# EAGLE design ct-Motor2 (EAGLE 4.15)
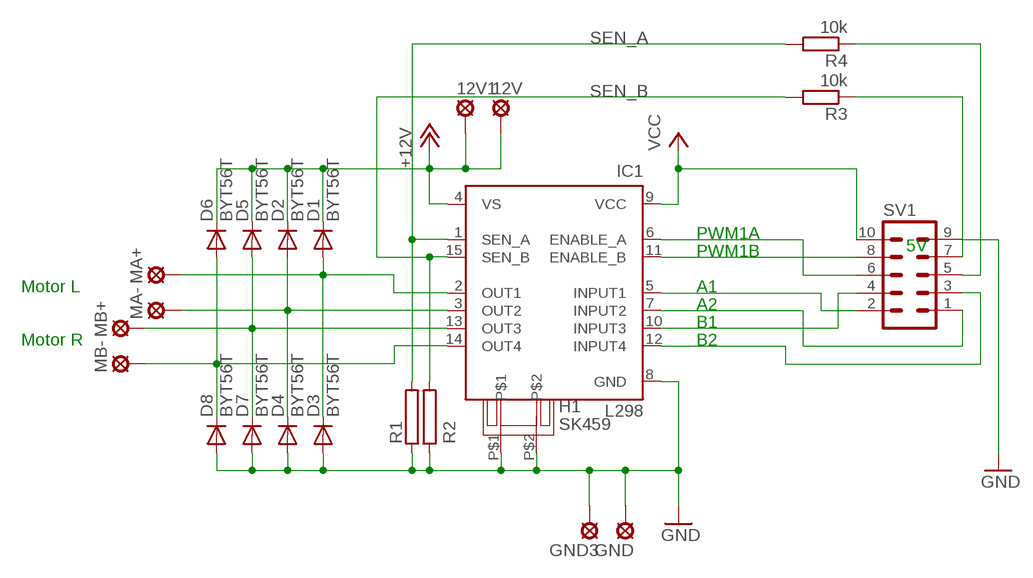
[diagram p0: schematic, sheet 1]

## Parts
12V  LSP10  [LSP10]
12V1  LSP10  [LSP10]
D1  BYT56T  [SOD64-18]
D2  BYT56T  [SOD64-18]
D3  BYT56T  [SOD64-18]
D4  BYT56T  [SOD64-18]
D5  BYT56T  [SOD64-18]
D6  BYT56T  [SOD64-18]
D7  BYT56T  [SOD64-18]
D8  BYT56T  [SOD64-18]
GND  LSP10  [LSP10]
GND3  LSP10  [LSP10]
H1  SK459  [SK459]
IC1  L298  [MULTIWATT-15]
MA+  LSP10  [LSP10]
MA-  LSP10  [LSP10]
MB+  LSP10  [LSP10]
MB-  LSP10  [LSP10]
R1  RKH208-8  [KH208-8]
R2  RKH208-8  [KH208-8]
R3  10k  R-EU_0207/10  [0207/10]
R4  10k  R-EU_0207/10  [0207/10]
SV1  ML10  [ML10]

## Nets
+12V [+12V]: 12V1.MP 12V.MP D1.C D2.C D5.C D6.C IC1.4(VS)
GND: D3.A D4.A D7.A D8.A GND3.MP GND.MP H1.P$1 H1.P$2 IC1.8(GND) R1.1 R2.1 SV1.9
M1: IC1.5(INPUT1) SV1.2
M2: IC1.10(INPUT3) SV1.4
MOTORA+ [MOTORA+]: D1.A D3.C IC1.2(OUT1) MA+.MP
MOTORA- [MOTORA-]: D2.A D4.C IC1.3(OUT2) MA-.MP
MOTORB+ [MOTORB+]: D5.A D7.C IC1.13(OUT3) MB+.MP
MOTORB- [MOTORb-]: D6.A D8.C IC1.14(OUT4) MB-.MP
N$1: R3.1 SV1.7
N$2: IC1.7(INPUT2) SV1.1
N$3: R4.1 SV1.5
N$4: IC1.12(INPUT4) SV1.3
PWM1A: IC1.6(ENABLE_A) SV1.6
PWM1B: IC1.11(ENABLE_B) SV1.8
SEN_A [+12V]: IC1.1(SEN_A) R1.2 R4.2
SEN_B [+12V]: IC1.15(SEN_B) R2.2 R3.2
VCC: IC1.9(VCC) SV1.10

## Notes on the sheet
- PWM1A | 5V
- PWM1B
- Motor L | A1
- A2
- B1
- Motor R | B2

## Library data of the parts
12V 12V1 GND GND3 MA+ MA- MB+ MB- = solpad:LSP10: SOLDER PAD drill 1.0 mm, distributor Buerklin, 12H555
D1-D8 = diode:BYT56T: DIODE diameter 4.8 mm, vertical, grid 10.16 mm
H1 = heatsink:SK459
IC1 = st-microelectronics:L298: DUAL FULL-BRIDGE DRIVER
R1 R2 = resistor-power:R: Power Resitor
R3 R4 = rcl:R-EU_: RESISTOR, European symbol
SV1 = con-harting-ml:ML10: HARTING

## Net classes
1 +12V: width 1.27 mm, drill 0.406 mm, clearance 0.584 mm
2 GND: width 1.016 mm, drill 0.406 mm
3 MOTORA+: width 1.27 mm, drill 0.813 mm, clearance 0.406 mm
4 MOTORA-: width 1.27 mm, drill 0.813 mm, clearance 0.406 mm
5 MOTORB+: width 1.27 mm, drill 0.813 mm, clearance 0.406 mm
6 MOTORb-: width 1.27 mm, drill 0.813 mm, clearance 0.406 mm

## Board
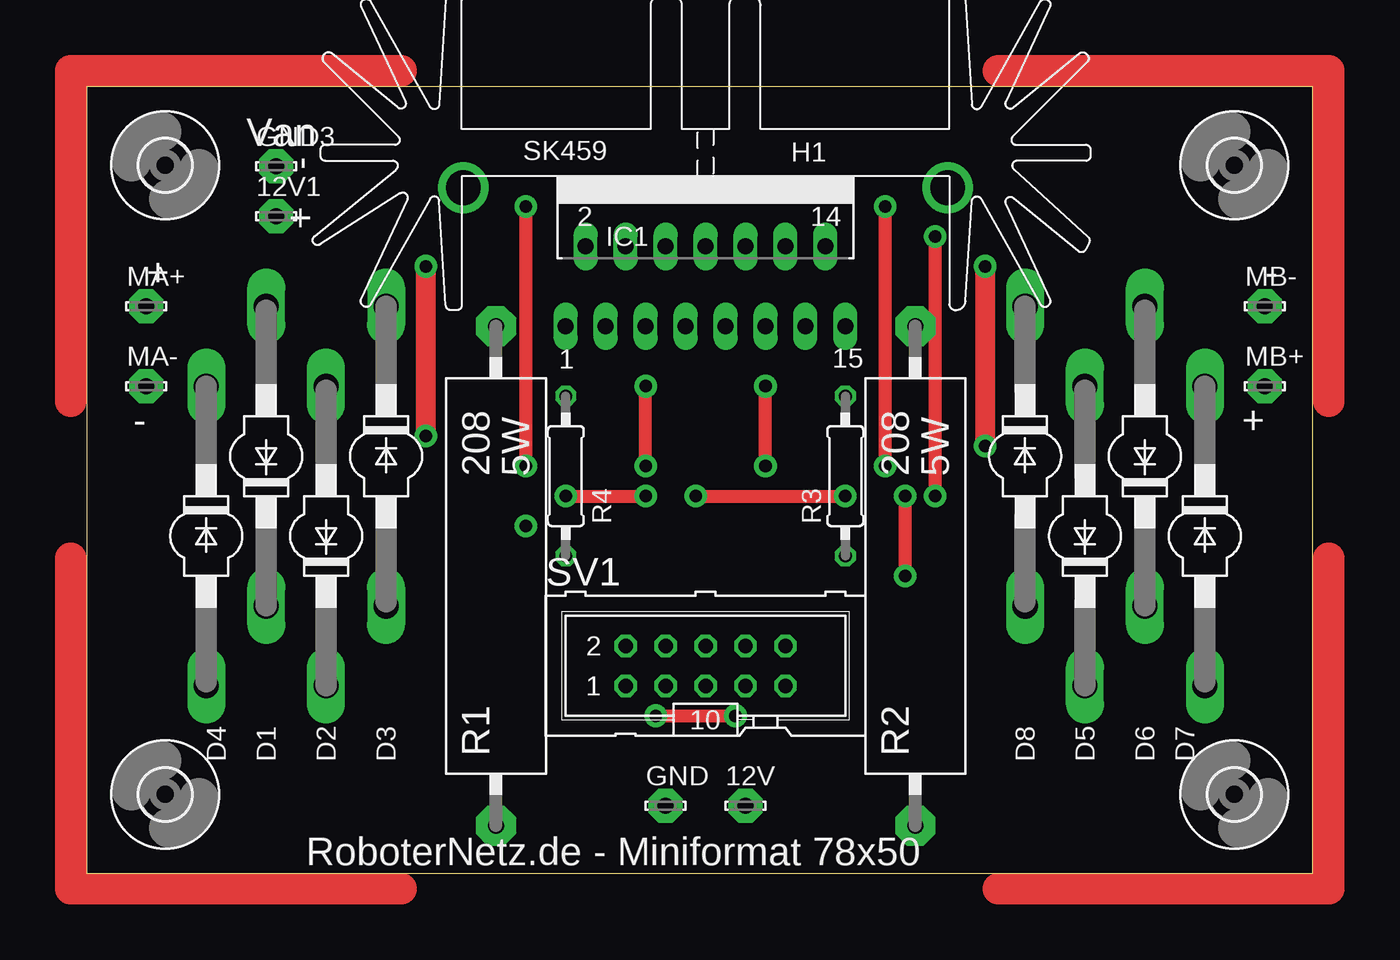
[diagram p1: board, top side]
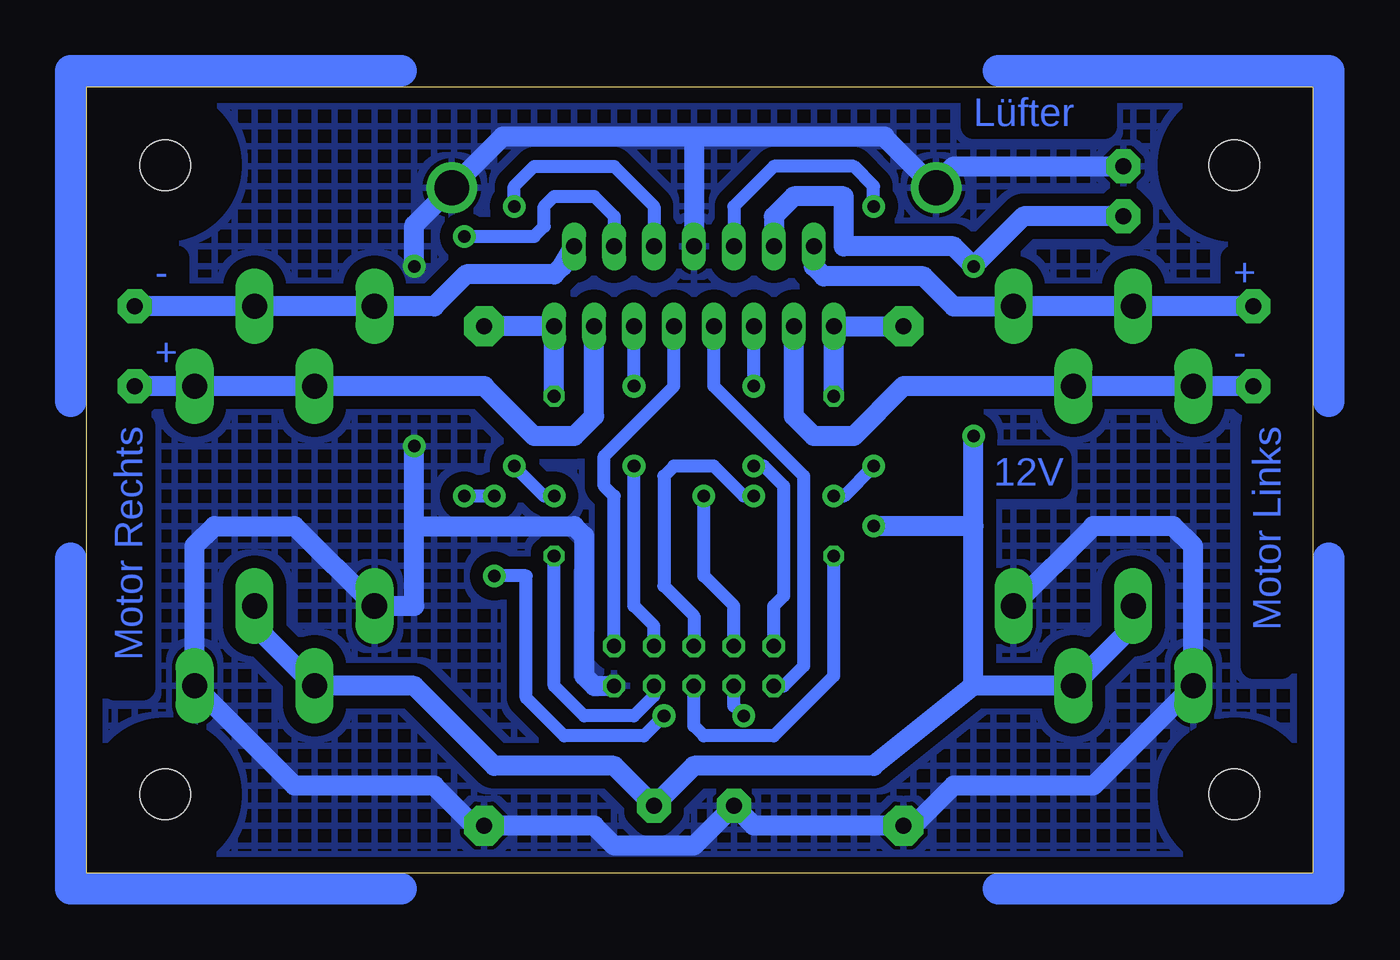
[diagram p2: board, bottom side, seen from below]

Size 78 x 50 mm. Coordinates in mm from the lower left corner, seen from the top.
Outline: 0,50 0,0 78,0 78,50 0,50
Copper layers (1*16): Top 0.035mm / dielectric 1.5mm / Bottom 0.035mm
Design rules "dick": minimum track width 32mil, minimum drill 24mil, track to track 16mil, track to pad 16mil, pad to pad 16mil, via to via 16mil, smd to smd 8mil, copper to edge 40mil, drill to drill 8mil, minimum pad ring 10mil, minimum via ring 8mil, stop-mask expansion 4mil, vias tented up to drill 0mil, thermal gap 10mil

### Footprints (pad centres in the part's own frame; a part is rotated, then mirrored left to right if it is on the bottom)
LSP10 = drill 1.016 pad 2.159 octagon: MP 0,0
SOD64-18 = drill 1.6 long: A 9.525,0; C -9.525,0
SK459 = drill 2.2 round: P$1 -15.4,0.72; P$2 15.4,0.72
MULTIWATT-15 = drill 1.016 long: 1 -8.89,-7.62; 2 -7.62,-2.54; 3 -6.35,-7.62; 4 -5.08,-2.54; 5 -3.81,-7.62; 6 -2.54,-2.54; 7 -1.27,-7.62; 8 0,-2.54; 9 1.27,-7.62; 10 2.54,-2.54; 11 3.81,-7.62; 12 5.08,-2.54; 13 6.35,-7.62; 14 7.62,-2.54; 15 8.89,-7.62
KH208-8 = drill 1.016 pad 2.54 octagon: 1 -15.875,0; 2 15.875,0
0207/10 = drill 0.813 octagon: 1 -5.08,0; 2 5.08,0
ML10 = drill 0.914 octagon: 1 -5.08,-1.27; 2 -5.08,1.27; 3 -2.54,-1.27; 4 -2.54,1.27; 5 0,-1.27; 6 0,1.27; 7 2.54,-1.27; 8 2.54,1.27; 9 5.08,-1.27; 10 5.08,1.27
3,2 = hole 3.2: 0,0

### Placement (x,y rotation side)
12V  41.91,4.28 0 top
12V1  12.06,41.75 0 top
D1  11.43,26.5 90 top
D2  15.24,21.43 90 top
D3  19.05,26.5 270 top
D4  7.62,21.43 270 top
D5  63.5,21.43 90 top
D6  67.31,26.5 90 top
D7  71.12,21.43 270 top
D8  59.69,26.5 270 top
GND  36.83,4.28 0 top
GND3  12.06,44.92 0 top
H1  39.37,44.29 180 top
IC1  39.37,42.38 0 top
MA+  3.81,36.03 0 top
MA-  3.81,30.95 0 top
MB+  74.93,30.95 0 top
MB-  74.93,36.03 0 top
R1  26.04,18.88 90 top
R2  52.7,18.88 90 top
R3  48.26,25.23 90 top
R4  30.48,25.23 90 top
SV1  39.37,13.17 0 top
U$1  [3,2]  5,45 270 top
U$2  [3,2]  5,5 270 top
U$3  [3,2]  73,45 270 top
U$4  [3,2]  73,5 270 top

### Tracks (layer width: path | path; a pad name or v marks a point on that pad's centre or on a via)
+12V  (via drill 0.8)
  Top 1.27: v21.59,27.77 v21.59,38.57
  Bottom 1.27: D6.C 67.31,15.71 D5.C 57.15,11.9 52.07,6.82 44.45,6.82 12V.MP 39.37,6.82 27.94,6.82 21.59,11.9 | D1.C 11.43,15.71 D2.C 21.59,11.9 | 21.59,11.9 21.59,22.06 | 21.59,22.06 v21.59,27.77 | IC1.4 34.29,41.75 33.02,43.02 29.84,43.02 29.84,39.84 22.86,39.84 v21.59,38.57 18.41,41.75 12V1.MP | 21.59,22.06 v27.94,22.06
GND  (via drill 0.8)
  Top 1.27: v57.15,27.14 v57.15,38.57
  Bottom 1.27: 45.72,3.01 R2.1 | 45.72,3.01 44.45,1.74 39.37,1.74 GND.MP 35.56,3.01 R1.1 25.4,3.01 22.86,5.55 13.97,5.55 D4.A 7.62,20.79 8.89,22.06 13.97,22.06 D3.A | 45.72,3.01 53.34,3.01 55.88,5.55 64.77,5.55 D7.A 71.12,20.79 69.85,22.06 64.77,22.06 D8.A 57.15,16.98 57.15,22.06 | 57.15,22.06 v57.15,27.14 | SV1.9 45.72,11.9 46.35,12.54 46.35,21.43 46.99,22.06 57.15,22.06 | 39.37,46.83 IC1.8 | 39.37,46.83 27.23,46.83 27.23,46.75 24.13,43.65 | 39.37,46.83 51.51,46.83 H1.P$1 57.15,41.19 v57.15,38.57 | GND3.MP 22.86,44.92 24.13,43.65 | 24.13,43.65 24.05,43.57 H1.P$2
  pour Bottom (isolate 0.813, hatched): 0,50 0,0.47 77.47,0.47 77.47,50
M1  (via drill 0.8)
  Top 0.813: v35.56,25.87 v35.56,30.95
  Bottom 0.813: v35.56,30.95 IC1.5 | SV1.2 34.29,16.98 33.66,17.61 33.66,24.6 34.92,25.87 v35.56,25.87
M2  (via drill 0.8)
  Top 0.813: v38.73,23.96 v48.26,23.96 | v50.8,25.87 v50.8,42.38
  Bottom 0.813: IC1.10 41.91,42.38 44.45,44.92 49.53,44.92 50.8,43.65 v50.8,42.38 | SV1.4 36.83,16.98 38.73,18.88 v38.73,23.96 | v48.26,23.96 48.9,23.96 v50.8,25.87
MOTORA+
  Bottom 1.27: MA+.MP D1.A D3.C 22.86,36.03 24.77,37.94 31.11,37.94 31.75,38.57 IC1.2
MOTORA-
  Bottom 1.27: MA-.MP D4.C D2.A 26.04,30.95 29.21,27.77 31.75,27.77 33.02,29.04 IC1.3
MOTORB+
  Bottom 1.27: MB+.MP D7.C D5.A 52.7,30.95 49.53,27.77 46.99,27.77 45.72,29.04 IC1.13
MOTORB-
  Bottom 1.27: IC1.14 47.75,38.57 48.26,38.06 53.85,38.06 55.88,36.03 D8.C D6.A MB-.MP
N$1
  Bottom 0.813: R3.1 48.26,11.9 46.35,9.99 43.18,9.99 41.91,11.26 SV1.7
N$2
  Bottom 0.813: SV1.1 33.66,11.9 32.38,13.17 32.38,25.23 38.1,30.95 IC1.7
N$3
  Bottom 0.813: R4.1 30.48,12.54 34.29,8.72 38.73,8.72 39.37,9.36 SV1.5
N$4  (via drill 0.8)
  Top 0.813: v53.98,23.96 v53.98,40.48 | v52.07,18.88 v52.07,23.96 | v36.2,9.99 v41.27,9.99 v36.2,9.99
  Bottom 0.813: v41.27,9.99 42.55,8.72 47.62,8.72 50.04,11.14 50.04,18.88 v52.07,18.88 | SV1.3 36.83,10.63 v36.2,9.99 | IC1.12 44.45,41.75 45.72,43.02 48.26,43.02 48.9,42.38 48.9,41.11 49.53,40.48 v53.98,40.48 | v52.07,23.96 v53.98,23.96
N$5
  Top 2: -1,30 -1,51 20,51
N$6
  Top 2: -1,20 -1,-1 20,-1
N$7
  Top 2: 79,30 79,51 58,51
N$8
  Top 2: 58,-1 79,-1 79,20
N$9
  Bottom 2: -1,30 -1,51 20,51
N$10
  Bottom 2: -1,20 -1,-1 20,-1
N$11
  Bottom 2: 79,30 79,51 58,51
N$12
  Bottom 2: 58,-1 79,-1 79,20
PWM1A  (via drill 0.8)
  Top 0.813: v30.48,23.96 v35.56,23.96 | v27.94,25.87 v27.94,42.38
  Bottom 0.813: v27.94,42.38 27.94,43.65 29.21,44.92 34.29,44.92 36.83,42.38 IC1.6 | v35.56,23.96 36.2,23.96 38.1,25.87 40.64,25.87 41.27,25.23 41.27,18.25 39.37,16.34 SV1.6 | v30.48,23.96 29.84,23.96 v27.94,25.87
PWM1B  (via drill 0.8)
  Top 0.813: v43.18,25.87 v43.18,30.95
  Bottom 0.813: v43.18,30.95 IC1.11 | SV1.8 41.91,15.71 43.18,16.98 v43.18,25.87
SEN_A
  Bottom 1.27: R4.2 IC1.1 R1.2
SEN_B
  Bottom 1.27: R3.2 IC1.15 R2.2
VCC
  Bottom 0.813: IC1.9 40.64,30.95 45.09,26.5 45.09,24.6 44.45,23.96 SV1.10

### Text on the board
Bottom: Lüfter | + | - | - | + | Motor Links | Motor Rechts | 12V
tPlace: Van | - | + | + | - | - | + | RoboterNetz.de - Miniformat 78x50